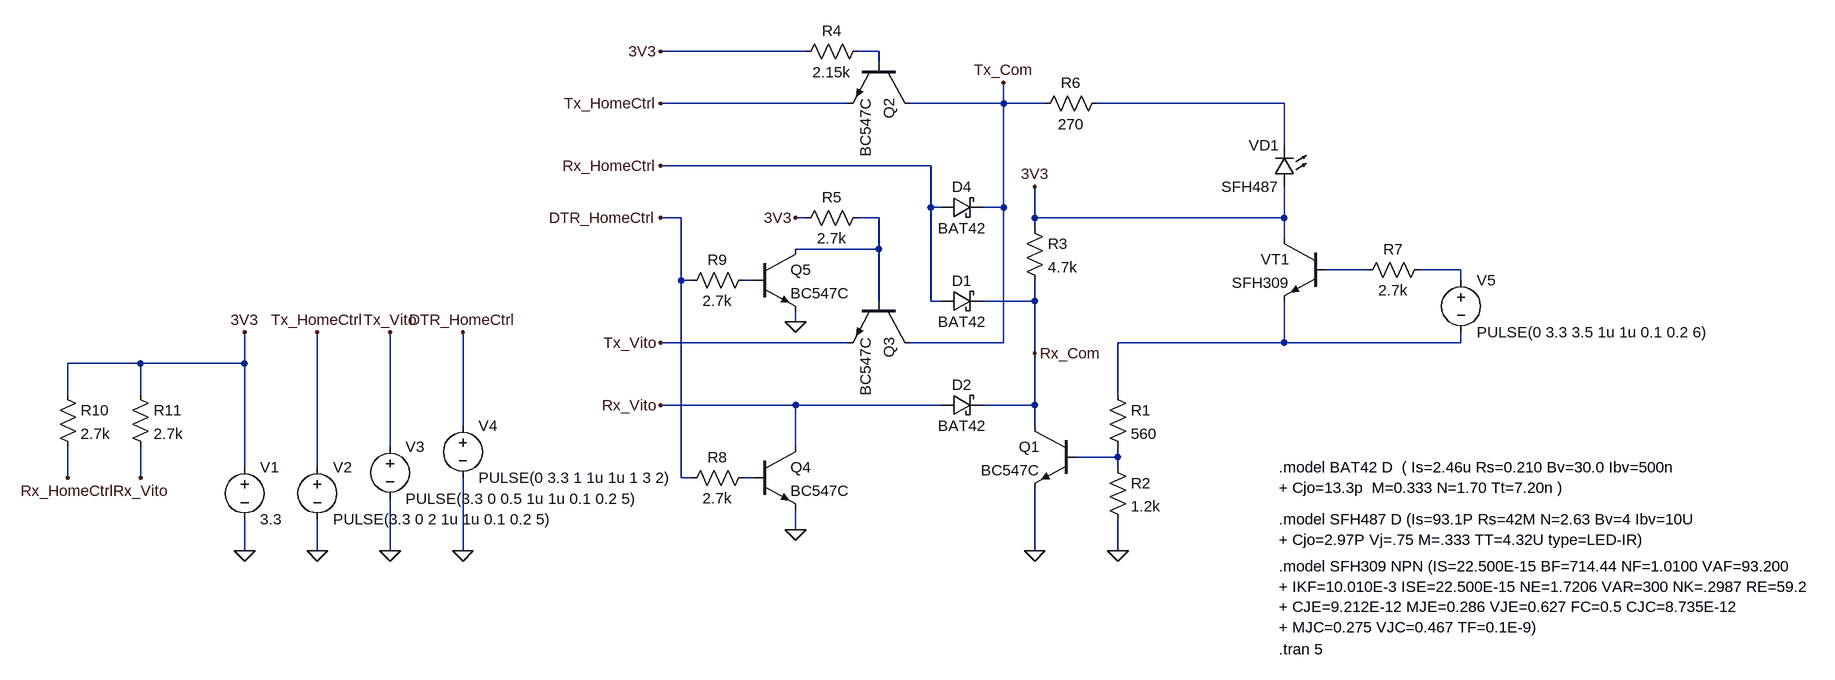
[diagram p0: schematic OptolinkDuoBlock.asc]
OptolinkDuoBlock.asc, the LTspice schematic file:
Version 4
SHEET 1 2356 680
WIRE -80 -1344 -304 -1344
WIRE 32 -1344 0 -1344
WIRE 32 -1328 32 -1344
WIRE -16 -1264 -304 -1264
WIRE 224 -1264 224 -1296
WIRE 224 -1264 80 -1264
WIRE 288 -1264 224 -1264
WIRE 656 -1264 368 -1264
WIRE 656 -1200 656 -1264
WIRE 112 -1168 -304 -1168
WIRE 112 -1104 112 -1168
WIRE 128 -1104 112 -1104
WIRE 224 -1104 224 -1264
WIRE 224 -1104 192 -1104
WIRE -272 -1088 -304 -1088
WIRE -80 -1088 -96 -1088
WIRE 32 -1088 0 -1088
WIRE 272 -1088 272 -1136
WIRE 656 -1088 656 -1136
WIRE 656 -1088 272 -1088
WIRE 272 -1072 272 -1088
WIRE 656 -1056 656 -1088
WIRE 32 -1040 32 -1088
WIRE 32 -1040 -96 -1040
WIRE 784 -1008 720 -1008
WIRE 928 -1008 864 -1008
WIRE -272 -992 -272 -1088
WIRE -256 -992 -272 -992
WIRE -160 -992 -176 -992
WIRE 928 -992 928 -1008
WIRE 32 -960 32 -1040
WIRE 112 -960 112 -1104
WIRE 128 -960 112 -960
WIRE 272 -960 272 -992
WIRE 272 -960 192 -960
WIRE -96 -928 -96 -944
WIRE -16 -896 -304 -896
WIRE 224 -896 224 -1104
WIRE 224 -896 80 -896
WIRE 656 -896 656 -960
WIRE 656 -896 400 -896
WIRE 928 -896 928 -912
WIRE 928 -896 656 -896
WIRE 272 -880 272 -960
WIRE -1104 -864 -1216 -864
WIRE -944 -864 -944 -912
WIRE -944 -864 -1104 -864
WIRE -1216 -816 -1216 -864
WIRE -1104 -816 -1104 -864
WIRE 400 -816 400 -896
WIRE -96 -800 -304 -800
WIRE 128 -800 -96 -800
WIRE 272 -800 272 -880
WIRE 272 -800 192 -800
WIRE -608 -768 -608 -912
WIRE 272 -768 272 -800
WIRE -720 -736 -720 -912
WIRE -96 -736 -96 -800
WIRE 400 -720 400 -736
WIRE 400 -720 336 -720
WIRE -944 -704 -944 -864
WIRE -832 -704 -832 -912
WIRE 400 -704 400 -720
WIRE -1216 -688 -1216 -736
WIRE -1104 -688 -1104 -736
WIRE -272 -688 -272 -992
WIRE -256 -688 -272 -688
WIRE -160 -688 -176 -688
WIRE -96 -608 -96 -640
WIRE -944 -576 -944 -624
WIRE -832 -576 -832 -624
WIRE -720 -576 -720 -656
WIRE -608 -576 -608 -688
WIRE 272 -576 272 -672
WIRE 400 -576 400 -624
FLAG 400 -576 0
FLAG 272 -576 0
FLAG -304 -800 Rx_Vito
FLAG -304 -1168 Rx_HomeCtrl
FLAG -304 -1264 Tx_HomeCtrl
FLAG -304 -896 Tx_Vito
FLAG -304 -1344 3V3
FLAG -832 -576 0
FLAG -720 -576 0
FLAG -944 -576 0
FLAG -944 -912 3V3
FLAG -720 -912 Tx_Vito
FLAG -832 -912 Tx_HomeCtrl
FLAG 272 -1136 3V3
FLAG 224 -1296 Tx_Com
FLAG 272 -880 Rx_Com
FLAG -304 -1088 DTR_HomeCtrl
FLAG -608 -576 0
FLAG -608 -912 DTR_HomeCtrl
FLAG -96 -928 0
FLAG -96 -1088 3V3
FLAG -96 -608 0
FLAG -1216 -688 Rx_HomeCtrl
FLAG -1104 -688 Rx_Vito
SYMBOL res 384 -832 R0
SYMATTR InstName R1
SYMATTR Value 560
SYMBOL res 384 -720 R0
SYMATTR InstName R2
SYMATTR Value 1.2k
SYMBOL npn 336 -768 M0
SYMATTR InstName Q1
SYMATTR Value BC547C
SYMBOL npn 80 -960 R90
SYMATTR InstName Q3
SYMATTR Value BC547C
SYMBOL schottky 128 -944 R270
WINDOW 0 32 32 VTop 2
WINDOW 3 0 32 VBottom 2
SYMATTR InstName D1
SYMATTR Value BAT42
SYMBOL schottky 128 -784 R270
WINDOW 0 32 32 VTop 2
WINDOW 3 0 32 VBottom 2
SYMATTR InstName D2
SYMATTR Value BAT42
SYMBOL res 16 -1104 R90
WINDOW 0 0 56 VBottom 2
WINDOW 3 32 56 VTop 2
SYMATTR InstName R5
SYMATTR Value 2.7k
SYMBOL npn 80 -1328 R90
SYMATTR InstName Q2
SYMATTR Value BC547C
SYMBOL res 16 -1360 R90
WINDOW 0 0 56 VBottom 2
WINDOW 3 32 56 VTop 2
SYMATTR InstName R4
SYMATTR Value 2.15k
SYMBOL res 384 -1280 R90
WINDOW 0 0 56 VBottom 2
WINDOW 3 32 56 VTop 2
SYMATTR InstName R6
SYMATTR Value 270
SYMBOL LED 672 -1136 R180
WINDOW 0 24 64 Left 2
WINDOW 3 24 0 Left 2
SYMATTR InstName VD1
SYMATTR Value SFH487
SYMBOL res 256 -1088 R0
SYMATTR InstName R3
SYMATTR Value 4.7k
SYMBOL schottky 128 -1088 R270
WINDOW 0 32 32 VTop 2
WINDOW 3 0 32 VBottom 2
SYMATTR InstName D4
SYMATTR Value BAT42
SYMBOL voltage -944 -720 R0
WINDOW 123 0 0 Left 0
WINDOW 39 0 0 Left 0
SYMATTR InstName V1
SYMATTR Value 3.3
SYMBOL voltage -832 -720 R0
WINDOW 123 0 0 Left 0
WINDOW 39 0 0 Left 0
SYMATTR InstName V2
SYMATTR Value PULSE(3.3 0 2 1u 1u 0.1 0.2 5)
SYMBOL voltage -720 -752 R0
WINDOW 123 0 0 Left 0
WINDOW 39 0 0 Left 0
SYMATTR InstName V3
SYMATTR Value PULSE(3.3 0 0.5 1u 1u 0.1 0.2 5)
SYMBOL npn 720 -1056 M0
SYMATTR InstName VT1
SYMATTR Value SFH309
SYMBOL res 880 -1024 R90
WINDOW 0 0 56 VBottom 2
WINDOW 3 32 56 VTop 2
SYMATTR InstName R7
SYMATTR Value 2.7k
SYMBOL voltage 928 -1008 R0
WINDOW 123 0 0 Left 0
WINDOW 39 0 0 Left 0
SYMATTR InstName V5
SYMATTR Value PULSE(0 3.3 3.5 1u 1u 0.1 0.2 6)
SYMBOL voltage -608 -784 R0
WINDOW 123 0 0 Left 0
WINDOW 39 0 0 Left 0
SYMATTR InstName V4
SYMATTR Value PULSE(0 3.3 1 1u 1u 1 3 2)
SYMBOL npn -160 -1040 R0
SYMATTR InstName Q5
SYMATTR Value BC547C
SYMBOL res -160 -704 R90
WINDOW 0 0 56 VBottom 2
WINDOW 3 32 56 VTop 2
SYMATTR InstName R8
SYMATTR Value 2.7k
SYMBOL npn -160 -736 R0
SYMATTR InstName Q4
SYMATTR Value BC547C
SYMBOL res -160 -1008 R90
WINDOW 0 0 56 VBottom 2
WINDOW 3 32 56 VTop 2
SYMATTR InstName R9
SYMATTR Value 2.7k
SYMBOL res -1232 -832 R0
SYMATTR InstName R10
SYMATTR Value 2.7k
SYMBOL res -1120 -832 R0
SYMATTR InstName R11
SYMATTR Value 2.7k
TEXT 648 -424 Left 2 !.tran 5
TEXT 648 -624 Left 2 !.model SFH487 D (Is=93.1P Rs=42M N=2.63 Bv=4 Ibv=10U\n+ Cjo=2.97P Vj=.75 M=.333 TT=4.32U type=LED-IR)
TEXT 648 -552 Left 2 !.model SFH309 NPN (IS=22.500E-15 BF=714.44 NF=1.0100 VAF=93.200\n+ IKF=10.010E-3 ISE=22.500E-15 NE=1.7206 VAR=300 NK=.2987 RE=59.2\n+ CJE=9.212E-12 MJE=0.286 VJE=0.627 FC=0.5 CJC=8.735E-12\n+ MJC=0.275 VJC=0.467 TF=0.1E-9)
TEXT 648 -704 Left 2 !.model BAT42 D  ( Is=2.46u Rs=0.210 Bv=30.0 Ibv=500n\n+ Cjo=13.3p  M=0.333 N=1.70 Tt=7.20n )

The netlist it stands for:
* OptolinkDuoBlock.asc
R1 N007 N008 560
R2 N008 0 1.2k
Q1 Rx_Com N008 0 0 BC547C
Q3 Tx_Com N003 Tx_Vito 0 BC547C
D1 Rx_HomeCtrl Rx_Com BAT42
D2 Rx_Vito Rx_Com BAT42
R5 N003 3V3 2.7k
Q2 Tx_Com N001 Tx_HomeCtrl 0 BC547C
R4 N001 3V3 2.15k
R6 N002 Tx_Com 270
D§VD1 3V3 N002 SFH487
R3 3V3 Rx_Com 4.7k
D4 Rx_HomeCtrl Tx_Com BAT42
V1 3V3 0 3.3
V2 Tx_HomeCtrl 0 PULSE(3.3 0 2 1u 1u 0.1 0.2 5)
V3 Tx_Vito 0 PULSE(3.3 0 0.5 1u 1u 0.1 0.2 5)
Q§VT1 3V3 N004 N007 0 SFH309
R7 N005 N004 2.7k
V5 N005 N007 PULSE(0 3.3 3.5 1u 1u 0.1 0.2 6)
V4 DTR_HomeCtrl 0 PULSE(0 3.3 1 1u 1u 1 3 2)
Q5 N003 N006 0 0 BC547C
R8 N009 DTR_HomeCtrl 2.7k
Q4 Rx_Vito N009 0 0 BC547C
R9 N006 DTR_HomeCtrl 2.7k
R10 3V3 Rx_HomeCtrl 2.7k
R11 3V3 Rx_Vito 2.7k
.model D D
.lib standard.dio
.model NPN NPN
.model PNP PNP
.lib standard.bjt
.tran 5
.model SFH487 D (Is=93.1P Rs=42M N=2.63 Bv=4 Ibv=10U
+ Cjo=2.97P Vj=.75 M=.333 TT=4.32U type=LED-IR)
.model SFH309 NPN (IS=22.500E-15 BF=714.44 NF=1.0100 VAF=93.200
+ IKF=10.010E-3 ISE=22.500E-15 NE=1.7206 VAR=300 NK=.2987 RE=59.2
+ CJE=9.212E-12 MJE=0.286 VJE=0.627 FC=0.5 CJC=8.735E-12
+ MJC=0.275 VJC=0.467 TF=0.1E-9)
.model BAT42 D  ( Is=2.46u Rs=0.210 Bv=30.0 Ibv=500n
+ Cjo=13.3p  M=0.333 N=1.70 Tt=7.20n )
.backanno
.end

* Results of the author's LTspice run, read from the files saved beside the schematic
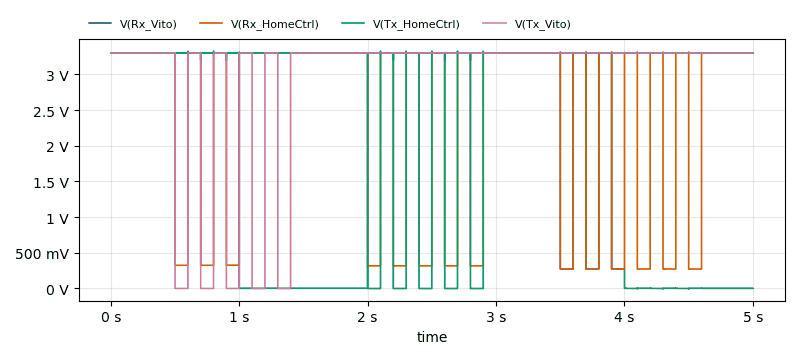
[diagram p1: Transient Analysis of OptolinkDuoBlock.asc, plotted from the saved traces]
* Transient Analysis, 1 run:
*   V(Rx_Vito): min -4.895 mV, max 3.325 V, average 1.799 V, rms 2.426 V, last 2.244 mV
*   V(Rx_HomeCtrl): min 271.5 mV, max 3.314 V, average 2.46 V, rms 2.804 V, last 3.299 V
*   V(Tx_HomeCtrl): min 0 V, max 3.3 V, average 2.97 V, rms 3.131 V, last 3.3 V
*   V(Tx_Vito): min 0 V, max 3.3 V, average 2.97 V, rms 3.131 V, last 3.3 V